# Altium project CAN-Junction.PrjPcb
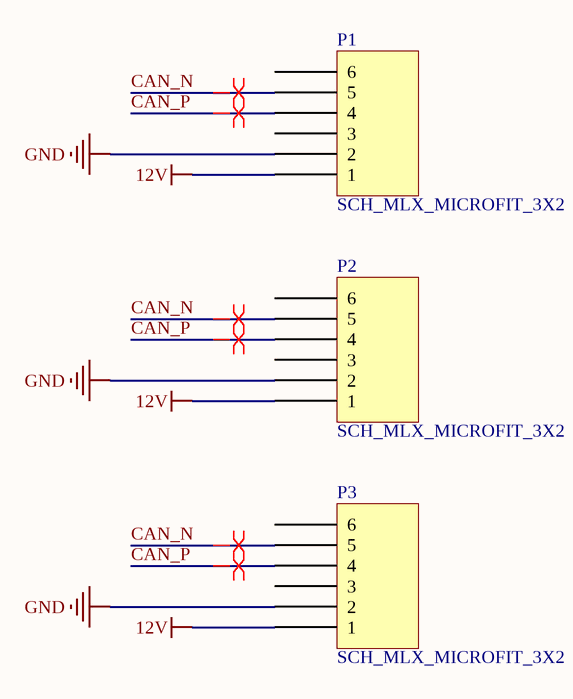
[diagram p0: CAN-Junction.SchDoc]
1 sheet, 3 parts. Net scope: global (net labels, ports and power ports of the same name join across sheets).
Board file: CAN-Junction.PcbDoc

## Sheet CAN-Junction.SchDoc
size A4

### Parts
P1  SCH_MLX_MICROFIT_3X2  [PCB_MLX_MICROFIT_3X2]
P2  SCH_MLX_MICROFIT_3X2  [PCB_MLX_MICROFIT_3X2]
P3  SCH_MLX_MICROFIT_3X2  [PCB_MLX_MICROFIT_3X2]

### Nets
12V: P1.1 P2.1 P3.1
GND: P1.2 P2.2 P3.2
CAN_N: P1.5 P2.5 P3.5
CAN_P: P1.4 P2.4 P3.4

Not connected (* = marked no-connect by the designer): P1 3 6; P2 3 6; P3 3 6

### Layout directives
differential pair: CAN_N, CAN_P